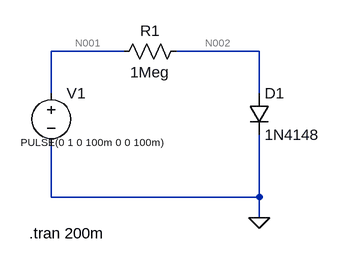
[diagram p0: schematic Draft1.asc]
Draft1.asc, the LTspice schematic file:
Version 4
SHEET 1 880 680
WIRE 128 64 16 64
WIRE 336 64 208 64
WIRE 16 128 16 64
WIRE 336 128 336 64
WIRE 16 288 16 208
WIRE 336 288 336 192
WIRE 336 288 16 288
WIRE 336 320 336 288
FLAG 336 320 0
SYMBOL voltage 16 112 R0
WINDOW 3 169 92 Right 1
WINDOW 123 0 0 Left 0
WINDOW 39 0 0 Left 0
SYMATTR InstName V1
SYMATTR Value PULSE(0 1 0 100m 0 0 100m)
SYMBOL res 224 48 R90
WINDOW 0 0 56 VBottom 2
WINDOW 3 32 56 VTop 2
SYMATTR InstName R1
SYMATTR Value 1Meg
SYMBOL diode 320 128 R0
SYMATTR InstName D1
SYMATTR Value 1N4148
TEXT -18 344 Left 2 !.tran 200m

The netlist it stands for:
* Draft1.asc
V1 N001 0 PULSE(0 1 0 100m 0 0 100m)
R1 N002 N001 1Meg
D1 N002 0 1N4148
.model D D
.lib standard.dio
.tran 200m
.backanno
.end

* Results of the author's LTspice run, read from the files saved beside the schematic
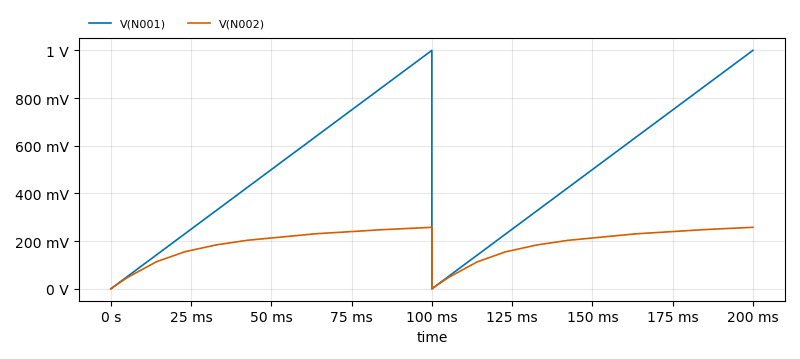
[diagram p1: Transient Analysis of Draft1.asc, plotted from the saved traces]
* Transient Analysis, 1 run:
*   V(N001): min 0 V, max 1 V, average 500 mV, rms 580.8 mV, last 1 V
*   V(N002): min 0 V, max 257.8 mV, average 190.7 mV, rms 201.8 mV, last 257.8 mV